# Altium schematic sheet FanConnector.SchDoc
size A4; SheetNumber: 4; SheetTotal: 11
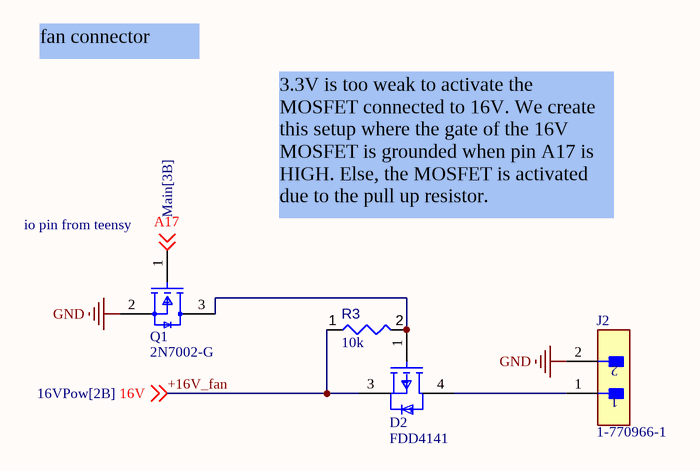
[diagram p0: FanConnector.SchDoc]

## Parts
D2  FDD4141  [FP-369AS-MFG]
J2  1-770966-1  [FP-1-770966-1-MFG]
Q1  2N7002-G  [FP-2N7002-G-IPC_C]
R3  value 10k  [RESC0402(1005)_L]  (hidden comment: Resistor 10K  +/-1 % 0402 63 mW)

## Nets
GND: J2.2 Q1.2(SOURCE)
+16V_fan: D2.3(S) R3.1 ; off-sheet 16V  [also labelled 16V]
A17: Q1.1(GATE) ; off-sheet A17
NetD2_1: D2.1(G) Q1.3(DRAIN) R3.2
NetD2_4: D2.4(D) J2.1

## Notes on the sheet
- fan connector
- (near Q1) io pin from teensy
- 3.3V is too weak to activate the MOSFET connected to 16V. We create this setup where the gate of the 16V MOSFET is grounded when pin A17 is HIGH. Else, the MOSFET is activated due to the pull up resistor.

## Library data of the parts
D2 = CMP-07173-000088-1: MOSFET P-CH 40V 10.8A DPAK; Manufacturer: ON Semiconductor; Gate Charge At Vgs: 36nC @ -10V; Transconductance: 38S; Drain To Source Breakdown Voltage: -40V; Reverse Recovery Time: 29ns; Pulse Drain Current: -100A; Reverse Recovery Charge: 26nC; Drain To Source Resistance: 10.1mΩ; Power Dissipation: 2.4W; Max Forward Diode Voltage: -1.2V; Turn Off Delay Time: 38ns; Number Of P Channels: 1; Gate To Source Voltage: 20V; Rthja Max: 52°C/W; Depletion Mode: False; Threshold Vgs Max: -3V; Threshold Vgs Min: -1V; Turn On Delay Time: 10ns; Max Junction Temp: +150°C; Input Capacitace At Vds: 2085pF @ -20V; Continuous Drain Current: -10.8A; Typ Forward Diode Voltage: -0.8V; Package: 369AS; Category: Diode; RoHS: TRUE; Device Class L2: Transistors; Octopart: https://octopart.com/fdd4141-on+semiconductor-84325802; Temperature: -55°C to +150°C; Drain To Source Voltage: -40V; Device Class L1: Discrete Semiconductors; Temperature Range Low: -55°C; Height: 2.517mm; ComponentLink2Description: Datasheet; Automotive: No; Number Of Channels: 1; Digikey Description: MOSFET P-CH 40V 10.8A DPAK; Lead Free: Yes; Manufacturer Part Number: FDD4141; Temperature Range High: +150°C; Footprint Url: https://www.onsemi.com/pub/Collateral/369AS.PDF; Device Class L3: MOSFETs; Mouser Description: MOSFET -40V P-Channel PowerTrench; ComponentLink2URL: https://www.onsemi.com/pub/Collateral/FDD4141-D.pdf
J2 = CMP-03369-000082-1: CONN HEADER R/A 2POS 4.14MM; Manufacturer: TE; Current Rating: 9.5A; Standoff Height: 0.63mm; Conn Gender: Male; Voltage Rating: 600V; Number Of Contacts: 2; Conn Orientation: Right Angle; Device Class L3: unset; Pitch: 4.14mm; Height: 7.9mm; Temperature Range High: +105°C; Octopart: https://octopart.com/1-770966-1-te+connectivity-46506767; Automotive: No; Digikey Description: CONN HEADER R/A 2POS 4.14MM; ComponentLink2URL: https://www.te.com/usa-en/product-1-770966-1.html?te_bu=Cor&te_type=other&te_campaign=oct_glo_cor-oct-global-oth-prtnr-fy19-oct-octo-buy-bom_sma-298_2&elqCampaignId=35216; Category: Conn; Lead Free: Yes; Mouser Description: Pin & Socket Connectors HEADER 2 POS R/A GOLD IN-LINE; ComponentLink2Description: Datasheet; Contact Material: Gold,Tin,Nickel; Device Class L1: Connectors; Number Of Rows: 1; Device Class L2: Headers and Wire Housings; Package: 1-770966-1; RoHS: TRUE; Manufacturer Part Number: 1-770966-1; Temperature: -55°C to +105°C; Temperature Range Low: -55°C
Q1 = CMP-06369-000003-1: MOSFET N-CH 60V 0.115A SOT23-3; Manufacturer: Microchip; Standoff Height: 0.01mm; Rthja Max: 203°C/W; Continuous Drain Current: 115mA; Depletion Mode: False; Typ Forward Diode Voltage: 1.2V; Number Of Channels: 1; Power Dissipation: 0.36W; Turn Off Delay Time: 20ns; Threshold Vgs Min: 1V; Threshold Vgs Max: 2.5V; Drain To Source Resistance: 7.5Ω; Input Capacitace At Vds: 50pF @ 25V; Reverse Recovery Time: 400ns; Pulse Drain Current: 800mA; Gate To Source Voltage: 30V; Manufacturer Part Number: 2N7002-G; Ambient Temperature Range Low: -55°C; Temperature Range Low: -55°C; ComponentLink2Description: Datasheet; Automotive: No; Temperature Range High: +150°C; Temperature: -55°C to +150°C; Ambient Temperature Range High: +150°C; ComponentLink2URL: http://ww1.microchip.com/downloads/en/DeviceDoc/2N7002-N-Channel-Enhancement-Mode-Vertical-DMOS-FET-Data-Sheet-20005797A.pdf; Octopart: https://octopart.com/2n7002-g-microchip-47153309; Mouser Description: Mosfet; N-channel Enhancement Mode; 60V; 7.5 OHM3 SOT-23T/R; Lead Free: Yes; Number Of N Channels: 1; Turn On Delay Time: 20ns; RoHS: TRUE; Digikey Description: MOSFET N-CH 60V 0.115A SOT23-3; Category: Trans; Ipc Land Pattern Name: SOT95P237X100-3; Height: 1.12mm; Device Class L2: Transistors; Drain To Source Breakdown Voltage: 60V; Device Class L1: Discrete Semiconductors; Drain To Source Voltage: 60V; Device Class L3: MOSFETs; Package: 2N7002-G
R3 = CMP-009-00149-3: Chip Resistor, 10 kOhms, +/-1 %, 63 mW, -55 to 125 degC, 0402; Power: 63mW; Tolerance: 1%; Min Operating Temperature: -55°C; Case/Package: 0402; Max Operating Temperature: 155°C; Pins: 2